# Altium schematic sheet CAN, JTAG, LDO, USB.SchDoc
size A; DocumentNumber: 7; SheetNumber: 7; SheetTotal: 16
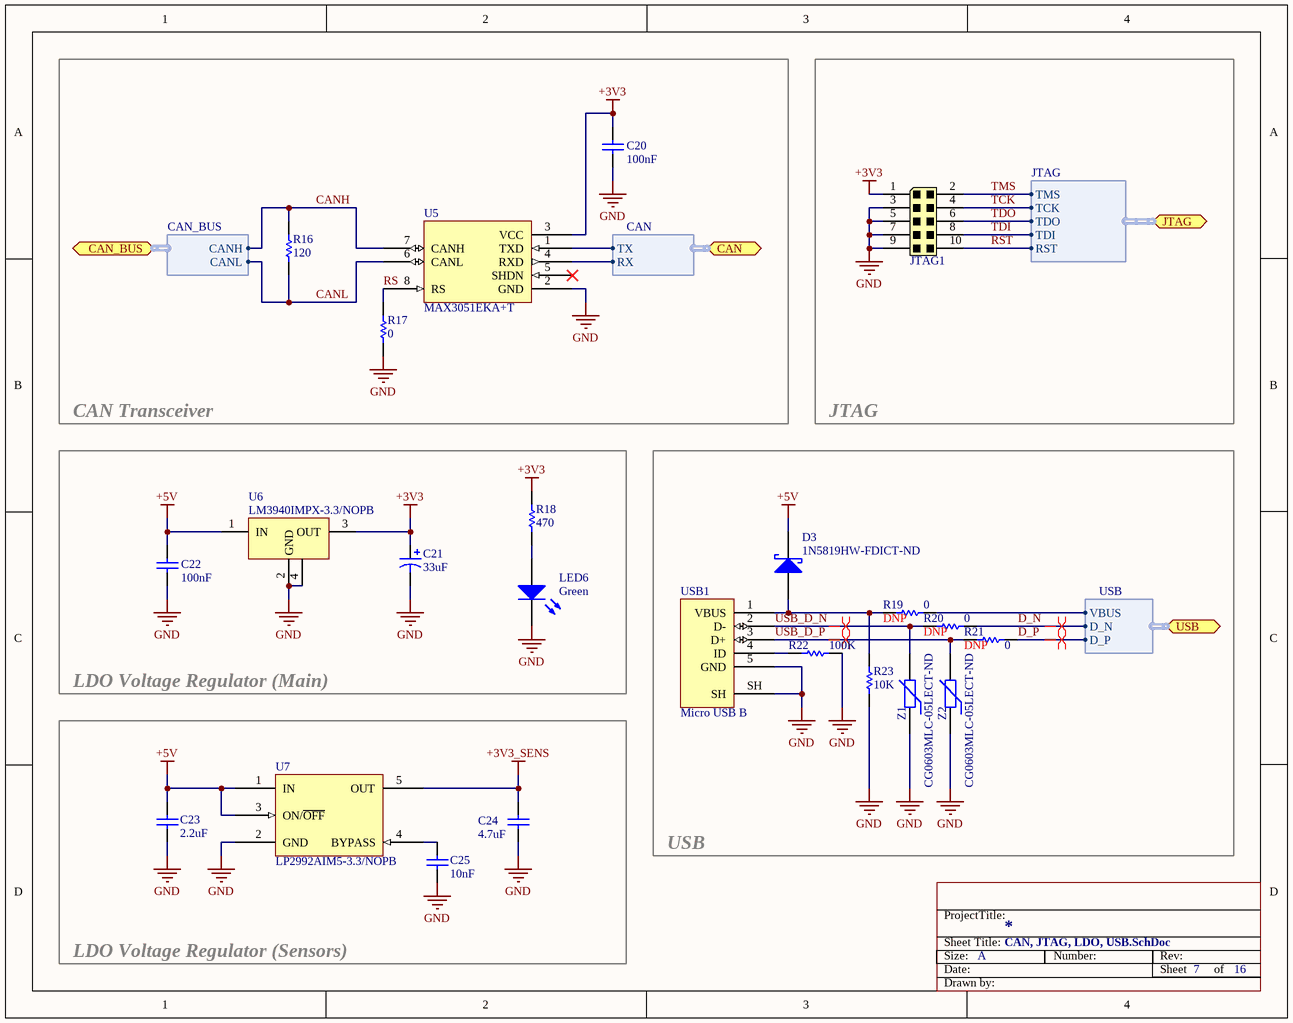
[diagram p0: CAN, JTAG, LDO, USB.SchDoc]

## Parts
C20  value 100nF  [CAP_0402[1005M]]  (hidden comment: Cap)
C21  value 33uF  [CAPMP3216X16N]  (hidden comment: CAP_POL)
C22  value 100nF  [CAP_0402[1005M]]  (hidden comment: Cap)
C23  value 2.2uF  [CAP_0402[1005M]]  (hidden comment: CAP)
C24  value 4.7uF  [CAP_0603[1608M]]  (hidden comment: CAP)
C25  value 10nF  [CAP_0402[1005M]]  (hidden comment: Cap)
D3  Supplier Part Number 1: 1N5819HW-FDICT-ND  [SOD-123]  (hidden comment: SCHOTTKY DIODE)
JTAG1  Mini JTAG 5x2 TH  [Header 5x2 1.27mm SMD]  (value not drawn)
LED6  Color: Green  [LED_0603[1608M]]  (hidden comment: LED)
R16  value 120  [RES_0402[1005M]]  (hidden comment: RES)
R17  value 0  [RES_0402[1005M]]  (hidden comment: RES)
R18  value 470  [RES_0402[1005M]]  (hidden comment: RES)
R19  value 0  Note: DNP  [RES_0402[1005M]]  (hidden comment: RES)
R20  value 0  Note: DNP  [RES_0402[1005M]]  (hidden comment: RES)
R21  value 0  Note: DNP  [RES_0402[1005M]]  (hidden comment: RES)
R22  value 100K  [RES_0402[1005M]]  (hidden comment: RES)
R23  value 10K  [RES_0402[1005M]]  (hidden comment: RES)
U5  Manufacturer Part Number: MAX3051EKA+T  [SOT23-8_N]  (hidden comment: MAX3051)
U6  LM3940IMPX-3.3/NOPB  [SOT223-3]
U7  Manufacturer Part Number: LP2992AIM5-3.3/NOPB  [SOT23-5_N]  (hidden comment: LP2992)
USB1  Micro USB B  [Micro USB B_SMT]
Z1  Supplier Part Number 1: CG0603MLC-05LECT-ND  [GEN2_0603[1608M]]  (hidden comment: CG0603MLC-05LE)
Z2  Supplier Part Number 1: CG0603MLC-05LECT-ND  [GEN2_0603[1608M]]  (hidden comment: CG0603MLC-05LE)

## Blocks framed on the sheet
CAN Transceiver: C20 R16 R17 U5
JTAG: JTAG1
LDO Voltage Regulator (Main): C21 C22 LED6 R18 U6
USB: D3 R19-R23 USB1 Z1 Z2
LDO Voltage Regulator (Sensors): C23-C25 U7

## Ports
CAN (harness CAN), CAN_BUS (harness CAN_BUS), JTAG (harness JTAG), USB (harness USB)

## Harnesses
JTAG: TMS, TCK, TDO, TDI, RST
CAN: TX, RX
CAN_BUS: CANH, CANL
USB: VBUS, D_N, D_P

## Nets
+3V3: C20.1 C21.1 JTAG1.1 R18.1 U5.3(VCC) U6.3(OUT)
+3V3_SENS: C24.2 U7.5(OUT)
+5V: C22.1 C23.2 D3.2(K) U6.1(IN) U7.1(IN) U7.3(ON/~{OFF})
GND: C20.2 C21.2 C22.2 C23.1 C24.1 C25.2 JTAG1.3 JTAG1.5 JTAG1.7 JTAG1.9 LED6.2(K) R17.1 R22.1 R23.1 U5.2(GND) U6.2(GND) U6.4(TAB) U7.2(GND) USB1.5(GND) USB1.SH Z1.1 Z2.1
CANH: R16.2 U5.7(CANH) ; port CAN_BUS.CANH
CANL: R16.1 U5.6(CANL) ; port CAN_BUS.CANL
D_N: R20.1 ; port USB.D_N
D_P: R21.1 ; port USB.D_P
RS: R17.2 U5.8(RS)
RST: JTAG1.10 ; port JTAG.RST
TCK: JTAG1.4 ; port JTAG.TCK
TDI: JTAG1.8 ; port JTAG.TDI
TDO: JTAG1.6 ; port JTAG.TDO
TMS: JTAG1.2 ; port JTAG.TMS
USB_D_N: R20.2 USB1.2(D-) Z1.2
USB_D_P: R21.2 USB1.3(D+) Z2.2
NetC25_1: C25.1 U7.4(BYPASS)
NetD3_1: D3.1(A) R19.1 R23.2 USB1.1(VBUS)
NetLED6_1: LED6.1(A) R18.2
NetR19_2: R19.2 ; port USB.VBUS
NetR22_2: R22.2 USB1.4(ID)
NetU5_1: U5.1(TXD) ; port CAN.TX
NetU5_4: U5.4(RXD) ; port CAN.RX

Not connected (* = marked no-connect by the designer): U5 5(SHDN)*

## Layout directives
differential pair: D_N, D_P, USB_D_N, USB_D_P

## Notes on the sheet
- Sheet Title:
- ProjectTitle:
- Size:
- Date:
- A
- Number:
- Rev:
- Sheet         of
- Drawn by:

## Library data of the parts
C20 C22 = Cap: Capacitor; Manufacturer: Yageo; Manufacturer Part Number: CC0402KRX7R6BB104; Supplier 1: Digi-Key; Supplier Part Number 1: 311-1345-1-ND; ComponentLink1URL: http://www.yageo.com/documents/recent/UPY-GPHC_X7R_6.3V-to-50V-v12.pdf; ComponentLink1Description: Datasheet
C21 = CAP_POL: Polarized Capacitor; Manufacturer: Kemet; Manufacturer Part Number: T491A336K010AT; Supplier 1: Digi-Key; Supplier Part Number 1: 399-5279-1-ND; ComponentLink1Description: Datasheet; ComponentLink1URL: http://www.kemet.com/Lists/ProductCatalog/Attachments/254/KEM_T2005_T491.pdf
C23 = CAP: Capacitor; Manufacturer: Yageo; Manufacturer Part Number: CC0402MRX5R5BB225; Supplier 1: Digi-Key; Supplier Part Number 1: 311-1442-1-ND; ComponentLink1URL: http://www.yageo.com/documents/recent/UPY-GPHC_X5R_4V-to-50V_19.pdf; ComponentLink1Description: Datasheet
C24 = CAP: Capacitor; Manufacturer: Yageo; Manufacturer Part Number: CC0603KRX5R6BB475; Supplier 1: Digi-Key; Supplier Part Number 1: 311-1455-1-ND; ComponentLink1URL: http://www.yageo.com/documents/recent/UPY-GPHC_X5R_4V-to-50V_19.pdf; ComponentLink1Description: Datasheet
C25 = Cap: Capacitor; Manufacturer: Yageo; Manufacturer Part Number: CC0402KRX7R7BB103; ComponentLink1URL: http://www.yageo.com/documents/recent/UPY-GPHC_X7R_6.3V-to-50V-v12.pdf; ComponentLink1Description: Datasheet; Supplier 1: Digi-Key; Supplier Part Number 1: 311-1042-1-ND
D3 = SCHOTTKY DIODE: Typical SchottkyDiode; Manufacturer: Diodes Incorporated; Manufacturer Part Number: 1N5819HW-7-F; Capacitance @ Vr, F: 60pF @ 4V, 1MHz; Current - Reverse Leakage @ Vr: 1mA @ 40V; Speed: Fast Recovery =< 500ns, > 200mA (Io); Voltage - Forward (Vf) (Max) @ If: 450mV @ 1A; Voltage - DC Reverse (Vr) (Max): 40V; Current - Average Rectified (Io): 1A; Supplier 1: Digi-Key; Diode Type: Schottky; ComponentLink1URL: http://www.diodes.com/_files/datasheets/ds30217.pdf; ComponentLink1Description: Datasheet
JTAG1 = Mini JTAG 5x2 TH: Mini JTAG connector header 10 pos 5x2 pitch 1.27mm TH; Manufacturer: Samtec Inc.; Manufacturer Part Number: FTSH-105-01-F-DV-K; Supplier 1: Digi-Key; Supplier Part Number 1: SAM8796-ND; ComponentLink1URL: http://suddendocs.samtec.com/prints/ftsh-1xx-xx-xxx-dv-xxx-mkt.pdf; ComponentLink1Description: Datasheet
LED6 = LED: LED GREEN CLEAR 0603 SMD; Manufacturer: Lite-On Inc.; Manufacturer Part Number: LTST-C190KGKT; Supplier 1: Digi-Key; Supplier Part Number 1: 160-1435-1-ND; ComponentLink1URL: http://optoelectronics.liteon.com/upload/download/DS22-2000-074/S_110_LTST-C190KGKT.pdf; ComponentLink1Description: Datasheet
R16 = RES: Resistor; Manufacturer: Yageo; Manufacturer Part Number: RC0402FR-07120RL; Supplier 1: Digi-Key; Supplier Part Number 1: 311-120LRCT-ND; ComponentLink1URL: http://www.yageo.com/NewPortal/yageodocoutput?fileName=/pdf/R-Chip/PYu-RC_Group_51_RoHS_L_3.pdf; ComponentLink1Description: Datasheet
R17 R19-R21 = RES: Resistor; Manufacturer Part Number: RC0402JR-070RL; Manufacturer: Yageo; Supplier 1: Digi-Key; Supplier Part Number 1: 311-0.0JRCT-ND; ComponentLink1URL: http://www.yageo.com/NewPortal/yageodocoutput?fileName=/pdf/R-Chip/PYu-RC_Group_51_RoHS_L_3.pdf; ComponentLink1Description: Datasheet
R18 = RES: Resistor; Manufacturer Part Number: RC0402JR-07470RL; Manufacturer: Yageo; Supplier 1: Digi-Key; Supplier Part Number 1: 311-470JRCT-ND; ComponentLink1URL: http://www.yageo.com/NewPortal/yageodocoutput?fileName=/pdf/R-Chip/PYu-RC_Group_51_RoHS_L_3.pdf; ComponentLink1Description: Datasheet
R22 = RES: Resistor; Manufacturer: Yageo; Manufacturer Part Number: RC0402FR-07100KL; Supplier 1: Digi-Key; Supplier Part Number 1: 311-100KLRCT-ND; ComponentLink1URL: http://www.yageo.com/NewPortal/yageodocoutput?fileName=/pdf/R-Chip/PYu-RC_Group_51_RoHS_L_3.pdf; ComponentLink1Description: Datasheet
R23 = RES: Resistor; Manufacturer: Yageo; Manufacturer Part Number: RC0402FR-0710KL; Supplier 1: Digi-Key; Supplier Part Number 1: 311-10.0KLRCT-ND; ComponentLink1URL: http://www.yageo.com/NewPortal/yageodocoutput?fileName=/pdf/R-Chip/PYu-RC_Group_51_RoHS_L_3.pdf; ComponentLink1Description: Datasheet
U5 = MAX3051: MAX3051 CAN Transceiver; Manufacturer: Maxim Integrated; Supplier 1: Digi-Key; Supplier Part Number 1: MAX3051EKA+TCT-ND; ComponentLink1URL: http://datasheets.maximintegrated.com/en/ds/MAX3051.pdf; ComponentLink1Description: Datasheet
U6 = LM3940IMPX-3.3/NOPB: IC REG LDO 3.3V 1A SOT223; Manufacturer: Texas Instruments; Supplier 1: Digi-Key; Supplier Part Number 1: LM3940IMPX-3.3/NOPBCT-ND; Manufacturer Part Number: LM3940IMPX-3.3/NOPB; ComponentLink1URL: http://www.ti.com/lit/ds/symlink/lm3940.pdf; ComponentLink1Description: Datasheet
U7 = LP2992: LP2992 LDO Voltage Regulator; Manufacturer: Texas Instruments; Voltage - Output: 3.3V; Current - Output: 250mA; Voltage - Dropout (Typical): 0.45V @ 250mA; Voltage - Input: Up to 16V; Supplier 1: Digi-Key; Supplier Part Number 1: LP2992AIM5-3.3/NOPBCT-ND; ComponentLink1URL: http://www.ti.com/lit/ds/symlink/lp2992.pdf; ComponentLink1Description: Datasheet
USB1 = Micro USB B: Micro USB Connector Type B; Manufacturer Part Number: 0473460001; Manufacturer: Molex, LLC; Supplier 1: Digi-Key; Supplier Part Number 1: WM17141CT-ND; ComponentLink1URL: http://www.molex.com/pdm_docs/sd/473460001_sd.pdf; ComponentLink1Description: Datasheet
Z1 Z2 = Res Varistor: VARISTOR 0603; Manufacturer: Bourns Inc.; Maximum DC Volts: 5VDC; Supplier 1: Digi-Key; Manufacturer Part Number: CG0603MLC-05LE; ComponentLink1URL: http://www.bourns.com/docs/Product-Datasheets/MLC.pdf; ComponentLink1Description: Datasheet